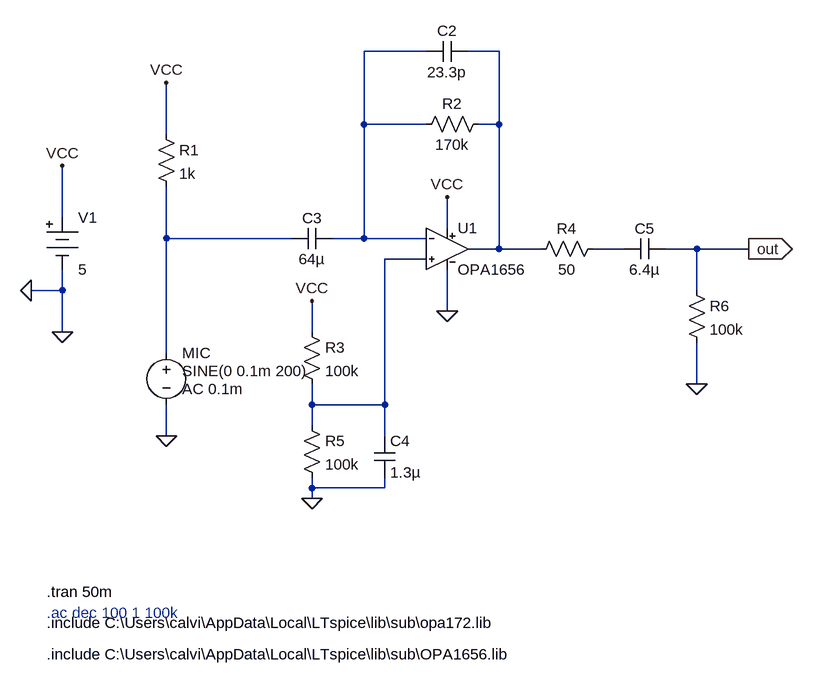
[diagram p0: schematic Microphone input.asc]
Microphone input.asc, the LTspice schematic file:
Version 4
SHEET 1 2224 792
WIRE 352 -176 256 -176
WIRE 464 -176 416 -176
WIRE 256 -64 256 -176
WIRE 352 -64 256 -64
WIRE 464 -64 464 -176
WIRE 464 -64 432 -64
WIRE -48 -48 -48 -128
WIRE -208 80 -208 0
WIRE 384 96 384 48
WIRE -48 112 -48 32
WIRE 144 112 -48 112
WIRE 256 112 256 -64
WIRE 256 112 208 112
WIRE 352 112 256 112
WIRE 464 128 464 -64
WIRE 464 128 416 128
WIRE 528 128 464 128
WIRE 656 128 608 128
WIRE 768 128 720 128
WIRE 848 128 768 128
WIRE 352 144 288 144
WIRE -208 192 -208 160
WIRE -208 192 -256 192
WIRE 768 192 768 128
WIRE 384 224 384 160
WIRE -208 256 -208 192
WIRE 176 256 176 208
WIRE -48 288 -48 112
WIRE 768 336 768 272
WIRE 176 368 176 336
WIRE 288 368 288 144
WIRE 288 368 176 368
WIRE 176 400 176 368
WIRE -48 416 -48 368
WIRE 288 416 288 368
WIRE 176 496 176 480
WIRE 288 496 288 480
WIRE 288 496 176 496
WIRE 176 512 176 496
FLAG -256 192 0
FLAG -208 0 VCC
FLAG 384 48 VCC
FLAG -48 -128 VCC
FLAG -48 416 0
FLAG 176 208 VCC
FLAG 176 512 0
FLAG 768 336 0
FLAG 848 128 out
IOPIN 848 128 Out
FLAG -208 256 0
FLAG 384 224 0
SYMBOL opa1656 384 64 R0
SYMATTR InstName U1
SYMATTR Value OPA1656
SYMBOL Misc\\battery -208 64 R0
WINDOW 123 0 0 Left 0
WINDOW 39 0 0 Left 0
SYMATTR InstName V1
SYMATTR Value 5
SYMBOL voltage -48 272 R0
WINDOW 123 24 72 Left 2
WINDOW 39 0 0 Left 0
WINDOW 3 24 44 Left 2
SYMATTR Value2 AC 0.1m
SYMATTR Value SINE(0 0.1m 200)
SYMATTR InstName MIC
SYMBOL res -64 -64 R0
SYMATTR InstName R1
SYMATTR Value 1k
SYMBOL cap 208 96 R90
WINDOW 0 0 32 VBottom 2
WINDOW 3 32 32 VTop 2
SYMATTR InstName C3
SYMATTR Value 64µ
SYMBOL res 448 -80 R90
WINDOW 0 0 56 VBottom 2
WINDOW 3 32 56 VTop 2
SYMATTR InstName R2
SYMATTR Value 170k
SYMBOL cap 416 -192 R90
WINDOW 0 0 32 VBottom 2
WINDOW 3 32 32 VTop 2
SYMATTR InstName C2
SYMATTR Value 23.3p
SYMBOL res 160 240 R0
SYMATTR InstName R3
SYMATTR Value 100k
SYMBOL res 160 384 R0
SYMATTR InstName R5
SYMATTR Value 100k
SYMBOL cap 272 416 R0
SYMATTR InstName C4
SYMATTR Value 1.3µ
SYMBOL res 624 112 R90
WINDOW 0 0 56 VBottom 2
WINDOW 3 32 56 VTop 2
SYMATTR InstName R4
SYMATTR Value 50
SYMBOL cap 720 112 R90
WINDOW 0 0 32 VBottom 2
WINDOW 3 32 32 VTop 2
SYMATTR InstName C5
SYMATTR Value 6.4µ
SYMBOL res 752 176 R0
SYMATTR InstName R6
SYMATTR Value 100k
TEXT -232 752 Left 2 !.include C:\\Users\\calvi\\AppData\\Local\\LTspice\\lib\\sub\\OPA1656.lib
TEXT -232 656 Left 2 !.tran 50m
TEXT -232 704 Left 2 !.include C:\\Users\\calvi\\AppData\\Local\\LTspice\\lib\\sub\\opa172.lib
TEXT -232 688 Left 2 ;.ac dec 100 1 100k

The netlist it stands for:
* Microphone input.asc
XU1 N005 N001 VCC 0 N002 OPA1656  ; pins IN+ IN- VCC VEE OUT
V1 VCC 0 5
V§MIC N003 0 SINE(0 0.1m 200) AC 0.1m
R1 VCC N003 1k
C3 N001 N003 64µ
R2 N002 N001 170k
C2 N002 N001 23.3p
R3 VCC N005 100k
R5 N005 0 100k
C4 N005 0 1.3µ
R4 N004 N002 50
C5 out N004 6.4µ
R6 out 0 100k
.include C:\Users\calvi\AppData\Local\LTspice\lib\sub\OPA1656.lib
.tran 50m
.include C:\Users\calvi\AppData\Local\LTspice\lib\sub\opa172.lib
* .ac dec 100 1 100k
.backanno
.end